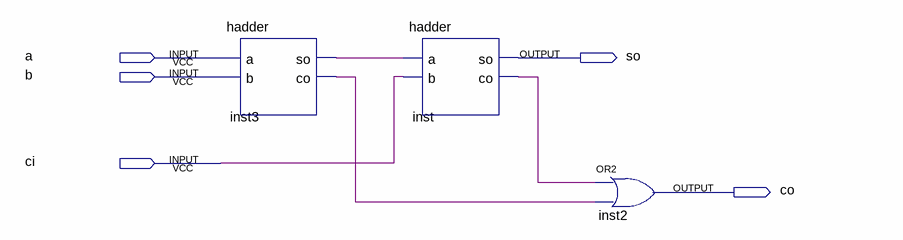
[diagram p0: schematic sheet]
// Quartus schematic fadder.bdf as structural Verilog: 3 symbols, 5 pins
module fadder (
  input  a,
  input  b,
  input  ci,
  output so,
  output co
);

  wire inst3_co, inst3_so, inst_co;

  hadder inst3 (.a(a), .b(b), .so(inst3_so), .co(inst3_co));
  hadder inst (.a(inst3_so), .b(ci), .so(so), .co(inst_co));
  or inst2 (co, inst_co, inst3_co);
endmodule
